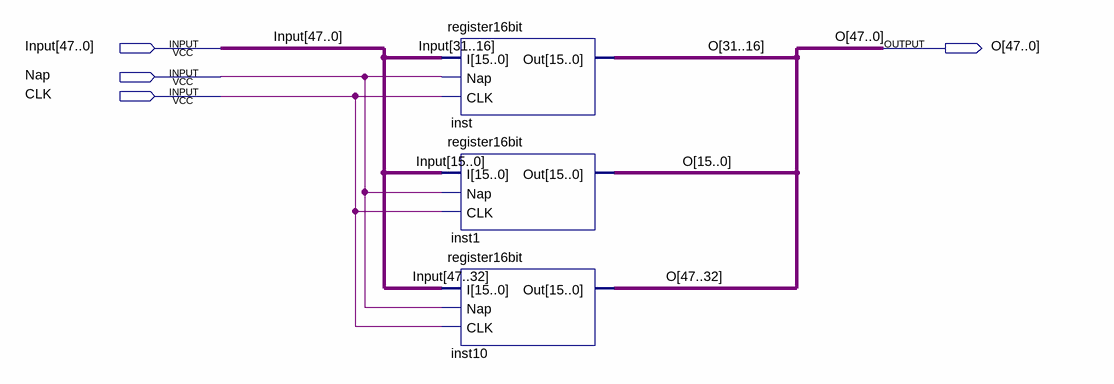
[diagram p0: schematic sheet]
// Quartus schematic Register48bit.bdf as structural Verilog: 3 symbols, 4 pins
module Register48bit (
  input  [47:0] Input,
  input  Nap,
  input  CLK,
  output [47:0] O
);

  register16bit inst (.I(Input[31:16]), .Nap(Nap), .CLK(CLK), .Out(O[31:16]));
  register16bit inst1 (.I(Input[15:0]), .Nap(Nap), .CLK(CLK), .Out(O[15:0]));
  register16bit inst10 (.I(Input[47:32]), .Nap(Nap), .CLK(CLK), .Out(O[47:32]));
endmodule
